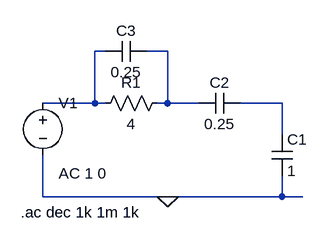
[diagram p0: schematic ej1_a.asc]
ej1_a.asc, the LTspice schematic file:
Version 4
SHEET 1 880 680
WIRE 96 16 80 16
WIRE 192 16 160 16
WIRE 80 96 80 16
WIRE 80 96 0 96
WIRE 96 96 80 96
WIRE 192 96 192 16
WIRE 192 96 176 96
WIRE 240 96 192 96
WIRE 368 96 304 96
WIRE 368 144 368 96
WIRE 0 240 0 176
WIRE 192 240 0 240
WIRE 368 240 368 208
WIRE 368 240 192 240
WIRE 400 240 368 240
FLAG 192 240 0
SYMBOL voltage 0 80 R0
WINDOW 123 24 124 Left 2
WINDOW 39 0 0 Left 0
SYMATTR InstName V1
SYMATTR Value ""
SYMATTR Value2 AC 1 0
SYMBOL cap 352 144 R0
SYMATTR InstName C1
SYMATTR Value 1
SYMBOL cap 304 80 R90
WINDOW 0 0 32 VBottom 2
WINDOW 3 32 32 VTop 2
SYMATTR InstName C2
SYMATTR Value 0.25
SYMBOL res 192 80 R90
WINDOW 0 0 56 VBottom 2
WINDOW 3 32 56 VTop 2
SYMATTR InstName R1
SYMATTR Value 4
SYMBOL cap 160 0 R90
WINDOW 0 0 32 VBottom 2
WINDOW 3 32 32 VTop 2
SYMATTR InstName C3
SYMATTR Value 0.25
TEXT -34 264 Left 2 !.ac dec 1k 1m 1k

The netlist it stands for:
* ej1_a.asc
V1 N001 0 AC 1 0
C1 N003 0 1
C2 N003 N002 0.25
R1 N002 N001 4
C3 N002 N001 0.25
.ac dec 1k 1m 1k
.backanno
.end